# EAGLE design modul_aid (EAGLE 7.3.0)
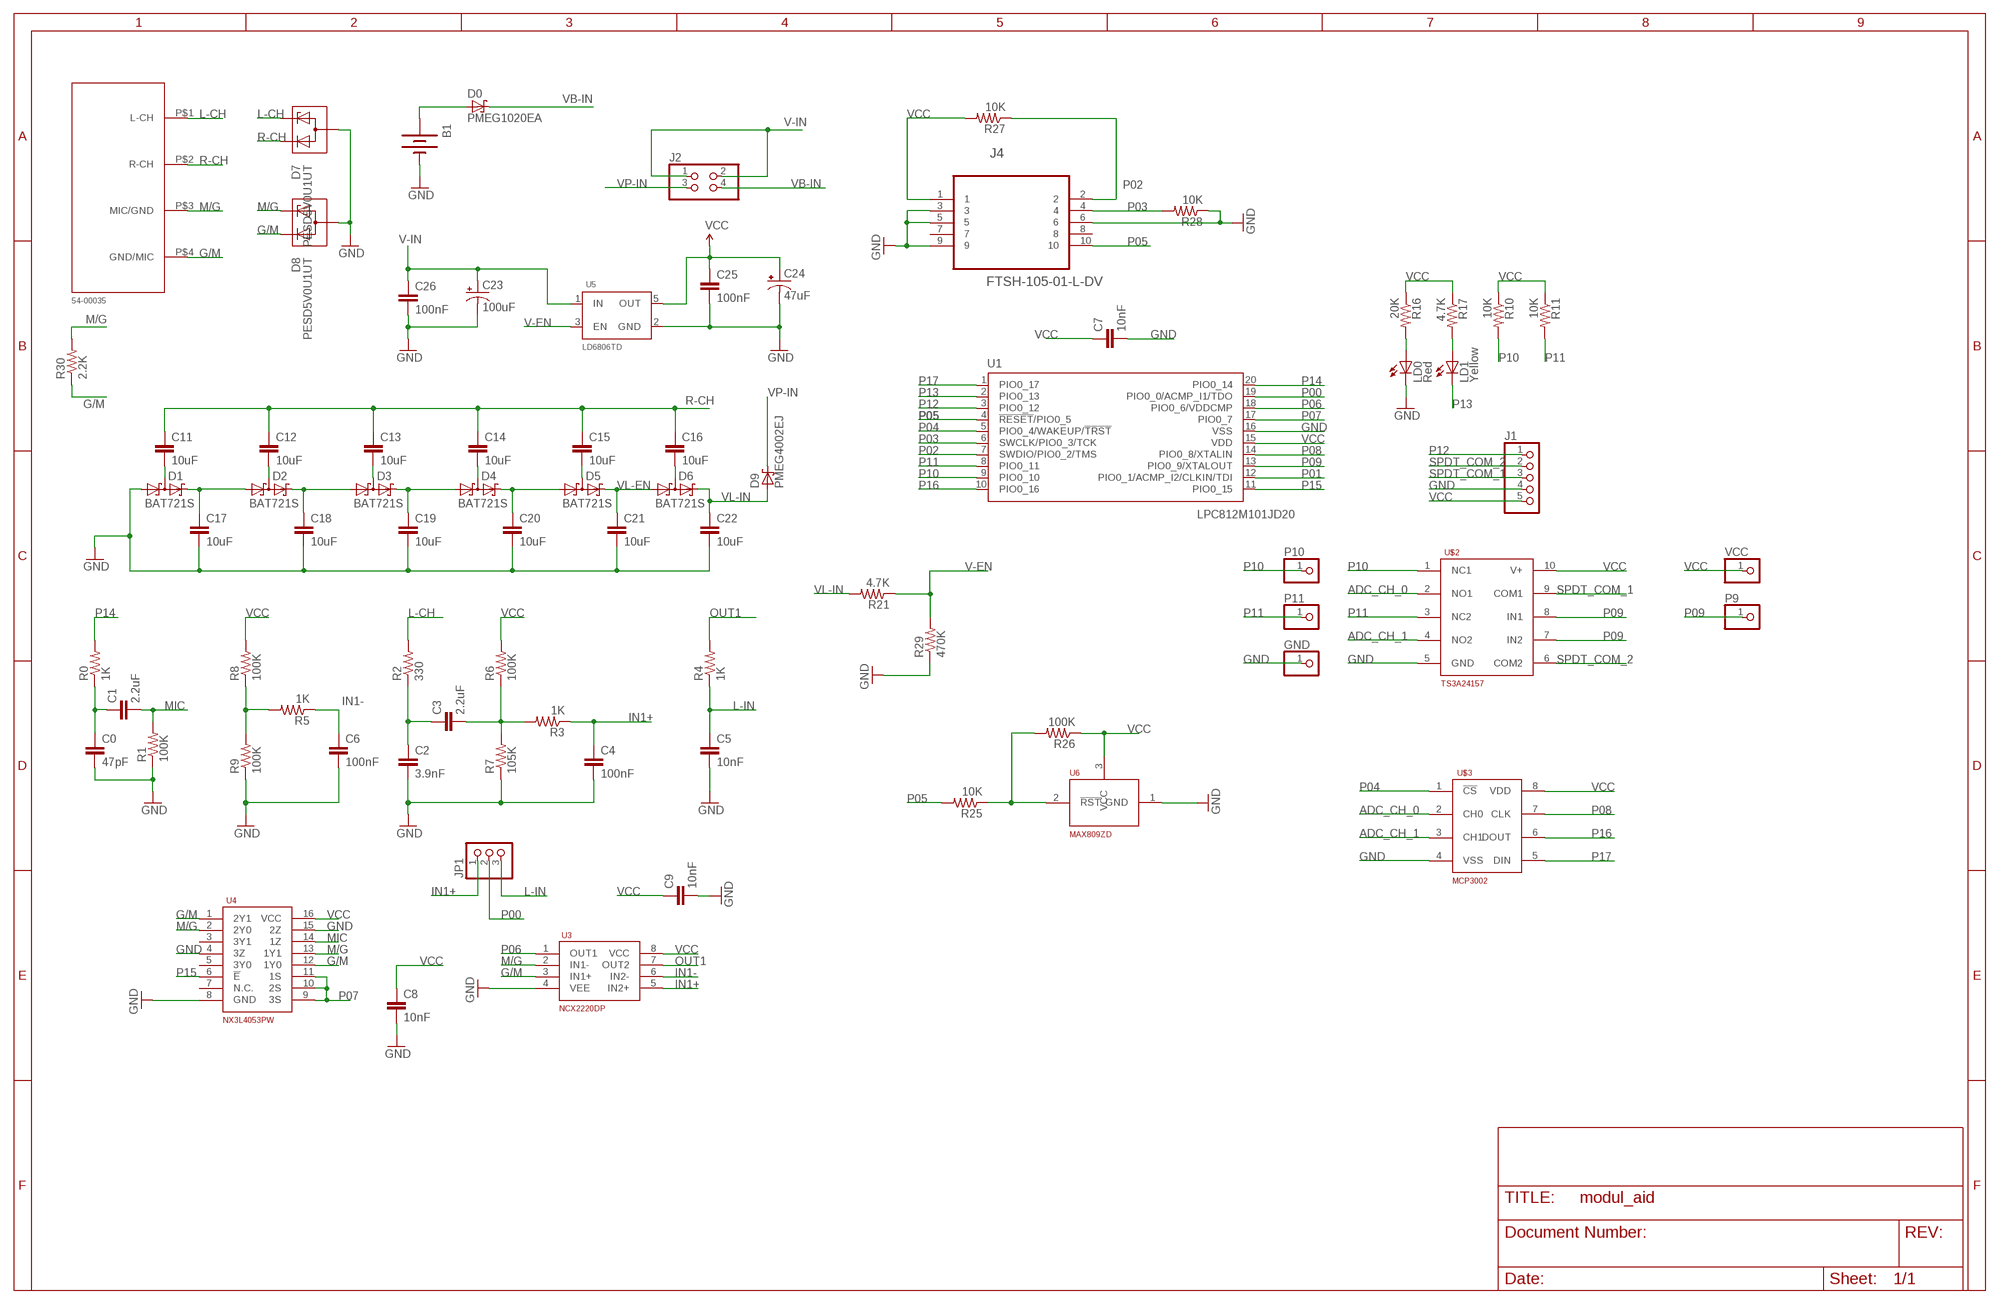
[diagram p0: schematic, sheet 1]

## Parts
B1  BATTERY20PTH  [BATTCOM_20MM_PTH]
C0  47pF  10UF10V10%(0805)  [0805-CAP]
C1  2.2uF  10UF10V10%(0805)  [0805-CAP]
C2  3.9nF  10UF10V10%(0805)  [0805-CAP]
C3  2.2uF  10UF10V10%(0805)  [0805-CAP]
C4  100nF  10UF10V10%(0805)  [0805-CAP]
C5  10nF  10UF10V10%(0805)  [0805-CAP]
C6  100nF  10UF10V10%(0805)  [0805-CAP]
C7  10nF  CAP0805  [0805]
C8  10nF  10UF10V10%(0805)  [0805-CAP]
C9  10nF  10UF10V10%(0805)  [0805-CAP]
C11  10uF  10UF10V10%(0805)  [0805-CAP]
C12  10uF  10UF10V10%(0805)  [0805-CAP]
C13  10uF  10UF10V10%(0805)  [0805-CAP]
C14  10uF  10UF10V10%(0805)  [0805-CAP]
C15  10uF  10UF10V10%(0805)  [0805-CAP]
C16  10uF  10UF10V10%(0805)  [0805-CAP]
C17  10uF  10UF10V10%(0805)  [0805-CAP]
C18  10uF  10UF10V10%(0805)  [0805-CAP]
C19  10uF  10UF10V10%(0805)  [0805-CAP]
C20  10uF  10UF10V10%(0805)  [0805-CAP]
C21  10uF  10UF10V10%(0805)  [0805-CAP]
C22  10uF  10UF10V10%(0805)  [0805-CAP]
C23  100uF  CAP_POL1206-KIT  [EIA3216-KIT]
C24  47uF  CAP_POL1206-KIT  [EIA3216-KIT]
C25  100nF  CAP0805  [0805]
C26  100nF  CAP0805  [0805]
D0  PMEG1020EA  [SOD323(F)]
D1  BAT721S  [SOT23]
D2  BAT721S  [SOT23]
D3  BAT721S  [SOT23]
D4  BAT721S  [SOT23]
D5  BAT721S  [SOT23]
D6  BAT721S  [SOT23]
D7  PESD5V0U1UT  [SOT23]
D8  PESD5V0U1UT  [SOT23]
D9  PMEG4002EJ  [SOD323(F)]
GND  PINHD-1X1  [1X01]
J1  PINHD-1X5  [1X05]
J2  PINHD-2X2  [2X02]
J4  FTSH-105-01-L-DV  [SAMTEC_FTSH-105-01-L-DV]
JP1  PINHD-1X3  [1X03]
LD0  Red  LEDSML0805  [SML0805]
LD1  Yellow  LEDSML0805  [SML0805]
P9  PINHD-1X1  [1X01]
P10  PINHD-1X1  [1X01]
P11  PINHD-1X1  [1X01]
R0  1K  RESISTOR0805-RES  [0805]
R1  100K  RESISTOR0805-RES  [0805]
R2  330  RESISTOR0805-RES  [0805]
R3  1K  RESISTOR0805-RES  [0805]
R4  1K  RESISTOR0805-RES  [0805]
R5  1K  RESISTOR0805-RES  [0805]
R6  100K  RESISTOR0805-RES  [0805]
R7  105K  RESISTOR0805-RES  [0805]
R8  100K  RESISTOR0805-RES  [0805]
R9  100K  RESISTOR0805-RES  [0805]
R10  10K  RESISTOR0805-RES  [0805]
R11  10K  RESISTOR0805-RES  [0805]
R16  20K  RESISTOR0805-RES  [0805]
R17  4.7K  RESISTOR0805-RES  [0805]
R21  4.7K  RESISTOR0805-RES  [0805]
R25  10K  RESISTOR0805-RES  [0805]
R26  100K  RESISTOR0805-RES  [0805]
R27  10K  RESISTOR0805-RES  [0805]
R28  10K  RESISTOR0805-RES  [0805]
R29  470K  RESISTOR0805-RES  [0805]
R30  2.2K  RESISTOR0805-RES  [0805]
U1  LPC812M101JD20  [SOT163-1]
U3  NCX2220DP  [SOT505-2]
U4  NX3L4053PW  [S0T403-1]
U5  LD6806TD  [SOT753]
U6  MAX809ZD  [SOT23-3]
U$2  TS3A24157  [VSSOP-10]
U$3  MCP3002  [SOIC8]
U$4  TENSILITY54-00035  [EE464SAUDIOJACK]
VCC  PINHD-1X1  [1X01]

## Nets
ADC_CH_0: U$2.2(NO1) U$3.2(CH0)
ADC_CH_1: U$2.4(NO2) U$3.3(CH1)
G/M: D8.2(KD) R30.1 U3.3(IN1+) U4.1(2Y1) U4.12(1Y0) U$4.P$4(GND/MIC)
GND: B1.2(-) C0.2 C2.2 C4.2 C5.2 C6.2 C7.2 C8.2 C9.2 C17.2 C18.2 C19.2 C20.2 C21.2 C22.2 C23.C(-) C24.C(-) C25.2 C26.2 D1.1(A1) D7.3(CA) D8.3(CA) GND.1 J1.4 J4.3 J4.5 J4.6 J4.9 LD0.C R1.1 R7.1 R9.1 R28.1 R29.1 U1.16(VSS) U3.4(VEE) U4.4(3Z) U4.8(GND) U4.15(2Z) U5.2(GND) U6.1(GND) U$2.5(GND) U$3.4(VSS)
IN1+: C4.1 JP1.1 R3.1 U3.5(IN2+)
IN1-: C6.1 R5.1 U3.6(IN2-)
L-CH: D7.1(KESD) R2.2 U$4.P$1(L-CH)
L-IN: C5.1 JP1.3 R4.1
M/G: D8.1(KESD) R30.2 U3.2(IN1-) U4.2(2Y0) U4.13(1Y1) U$4.P$3(MIC/GND)
MIC: C1.2 R1.2 U4.14(1Z)
N$1: C11.2 D1.3(K1A2)
N$2: C12.2 D2.3(K1A2)
N$3: C13.2 D3.3(K1A2)
N$4: C14.2 D4.3(K1A2)
N$5: C15.2 D5.3(K1A2)
N$6: C16.2 D6.3(K1A2)
N$7: B1.1(+) D0.2(A)
N$8: C0.1 C1.1 R0.1
N$9: C17.1 D1.2(K2) D2.1(A1)
N$10: C18.1 D2.2(K2) D3.1(A1)
N$11: C19.1 D3.2(K2) D4.1(A1)
N$12: C20.1 D4.2(K2) D5.1(A1)
N$13: R5.2 R8.1 R9.2
N$14: C2.1 C3.1 R2.1
N$16: R25.1 R26.2 U6.2(!RST)
N$17: C3.2 R3.2 R6.1 R7.2
N$18: LD0.A R16.2
N$19: LD1.A R17.2
OUT1: R4.2 U3.7(OUT2)
P00: JP1.2 U1.19(PIO0_0/ACMP_I1/TDO)
P01: U1.12(PIO0_1/ACMP_I2/CLKIN/TDI)
P02: J4.2 R27.1 U1.7(SWDIO/PIO0_2/TMS)
P03: J4.4 R28.2 U1.6(SWCLK/PIO0_3/TCK)
P04: U1.5(PIO0_4/WAKEUP/!TRST!) U$3.1(!CS)
P05: J4.10 R25.2 U1.4(!RESET!/PIO0_5)
P06: U1.18(PIO0_6/VDDCMP) U3.1(OUT1)
P07: U1.17(PIO0_7) U4.9(3S) U4.10(2S) U4.11(1S)
P08: U1.14(PIO0_8/XTALIN) U$3.7(CLK)
P09: P9.1 U1.13(PIO0_9/XTALOUT) U$2.7(IN2) U$2.8(IN1)
P10: P10.1 R10.2 U1.9(PIO0_10) U$2.1(NC1)
P11: P11.1 R11.2 U1.8(PIO0_11) U$2.3(NC2)
P12: J1.1 U1.3(PIO0_12)
P13: LD1.C U1.2(PIO0_13)
P14: R0.2 U1.20(PIO0_14)
P15: U1.11(PIO0_15) U4.6(!E)
P16: U1.10(PIO0_16) U$3.6(DOUT)
P17: U1.1(PIO0_17) U$3.5(DIN)
R-CH: C11.1 C12.1 C13.1 C14.1 C15.1 C16.1 D7.2(KD) U$4.P$2(R-CH)
SPDT_COM_1: J1.3 U$2.9(COM1)
SPDT_COM_2: J1.2 U$2.6(COM2)
V-EN: R21.1 R29.2 U5.3(EN)
V-IN: C23.A(+) C26.1 J2.1 J2.2 U5.1(IN)
VB-IN: D0.1(K) J2.4
VCC: C7.1 C8.1 C9.1 C24.A(+) C25.1 J1.5 J4.1 R6.2 R8.2 R10.1 R11.1 R16.1 R17.1 R26.1 R27.2 U1.15(VDD) U3.8(VCC) U4.16(VCC) U5.5(OUT) U6.3(VCC) U$2.10(V+) U$3.8(VDD) VCC.1
VL-EN: C21.1 D5.2(K2) D6.1(A1)
VL-IN: C22.1 D6.2(K2) D9.2(A) R21.2
VP-IN: D9.1(K) J2.3
Unconnected: J4.7 J4.8 U4.3(3Y1) U4.5(3Y0) U4.7(N.C.)

## Library data of the parts
B1 = SparkFun-Electromechanical:BATTERY: Battery Holders Various common sizes : AA, AAA, 18650 (PRT-12895), 20mm coin cell and 12mm coin cell. 20MM_4LEGS, BATT-10373
C0 C1-C6 C8 C9 C11-C22 = SparkFun-Capacitors:10UF10V10%(0805): CAP-11330; PROD_ID: CAP-11330
C7 C25 C26 = SparkFun-Capacitors:CAP: Capacitor Standard 0603 ceramic capacitor, and 0.1" leaded capacitor.
C23 C24 = SparkFun-Capacitors:CAP_POL: Capacitor Polarized These are standard SMD and PTH capacitors. Normally 10uF, 47uF, and 100uF in electrolytic and tantalum varieties. Always verify the external diameter of the through hole cap, it varies with capacity, voltage, and manufacturer. The EIA devices should be standard.
D0 = NXP_60_26022015:PMEG1020E: 10 V, 2 A ultra low VF MEGA Schottky barrier rectifiers Planar Maximum Efficiency General Application (MEGA) Schottky barrier rectifiers with an integrated guard ring for stress protection, encapsulated in small and flat lead plastic SMD packages. AAL Eindhoven MK
D1-D6 = NXP_60_26022015:BAT721S: Schottky barrier diodes in small packages Planar Schottky barrier diodes with an integrated guard ring for stress protection. Encapsulated in small Surface-Mounted Device (SMD) plastic packages. AAL Eindhoven MK
D7 D8 = NXP_60_26022015:PESD5V0U1UT: Ultra low capacitance ESD protection diode in SOT23 package Ultra low capacitance ElectroStatic Discharge (ESD) protection diode in a SOT23 (TO-236AB) small SMD plastic package designed to protect one high-speed data line from the damage caused by ESD and other transients. AAL Eindhoven MK
D9 = NXP_60_26022015:PMEG4002: 40 V 0.2 A Very low VF MEGA Schottky barrier rectifier Planar Maximum Efficiency General Application (MEGA) Schottky barrier rectifier with an integrated guard ring for stress protection, encapsulated in a SOD323 (SC-76) very small SMD plastic packag AAL Eindhoven MK
GND P9-P11 VCC = pinhead:PINHD-1X1: PIN HEADER
J1 = pinhead:PINHD-1X5: PIN HEADER
J2 = pinhead:PINHD-2X2: PIN HEADER
J4 = SAMTEC-HTSW-FTxx_By_element14_Batch_1:FTSH-105-01-L-DV: CONN HEADER, 1.27MM, 2X5WAY, SMT; MPN: FTSH-105-01-L-DV; OC_FARNELL: 1667759; OC_NEWARK: 11P4814; PACKAGE: HEADER, 1.27MM, 2X5WAY, SMT; SUPPLIER: SAMTEC
JP1 = pinhead:PINHD-1X3: PIN HEADER
LD0 LD1 = led:LED: LED OSRAM: - CHIPLED LG R971, LG N971, LY N971, LG Q971, LY Q971, LO R971, LY R971 LH N974, LH R974 LS Q976, LO Q976, LY Q976 LO Q996 - Hyper CHIPLED LW Q18S LB Q993, LB Q99A, LB R99A - SideLED LS A670, LO A670, LY A670, LG A670, LP A670 LB A673, LV A673, LT A673, LW A673 LH A674 LY A675 LS A676, LA A676, LO A676, LY A676, LW A676 LS A679, LY A679, LG A679 - Hyper Micro SIDELED® LS Y876, LA Y876, LO Y876, LY Y876 LT Y87S - SmartLED LW L88C, LW L88S LB L89C, LB L89S, LG L890 LS L89K, LO L89K, LY L89K LS L896, LA L896, LO L896, LY L896 - TOPLED LS T670, LO T670, LY T670, LG T670, LP T670 LSG T670, LSP T670, LSY T670, LOP T670, LYG T670 LG T671, LOG T671, LSG T671 LB T673, LV T673, LT T673, LW T673 LH T674 LS T676, LA T676, LO T676, LY T676, LB T676, LH T676, LSB T676, LW T676 LB T67C, LV T67C, LT T67C, LS T67K, LO T67K, LY T67K, LW E67C LS E67B, LA E67B, LO E67B, LY E67B, LB E67C, LV E67C, LT E67C LW T67C LS T679, LY T679, LG T679 LS T770, LO T770, LY T770, LG T770, LP T770 LB T773, LV T773, LT T773, LW T773 LH T774 LS E675, LA E675, LY E675, LS T675 LS T776, LA T776, LO T776, LY T776, LB T776 LHGB T686 LT T68C, LB T68C - Hyper Mini TOPLED® LB M676 - Mini TOPLED Santana® LG M470 LS M47K, LO M47K, LY M47K Source: http://www.osram.convergy.de LUXEON: - LUMILED® LXK2-PW12-R00, LXK2-PW12-S00, LXK2-PW14-U00, LXK2-PW14-V00 LXK2-PM12-R00, LXK2-PM12-S00, LXK2-PM14-U00 LXK2-PE12-Q00, LXK2-PE12-R00, LXK2-PE12-S00, LXK2-PE14-T00, LXK2-PE14-U00 LXK2-PB12-K00, LXK2-PB12-L00, LXK2-PB12-M00, LXK2-PB14-N00, LXK2-PB14-P00, LXK2-PB14-Q00 LXK2-PR12-L00, LXK2-PR12-M00, LXK2-PR14-Q00, LXK2-PR14-R00 LXK2-PD12-Q00, LXK2-PD12-R00, LXK2-PD12-S00 LXK2-PH12-R00, LXK2-PH12-S00 LXK2-PL12-P00, LXK2-PL12-Q00, LXK2-PL12-R00 Source: www.luxeon.com KINGBRIGHT: KA-3528ASYC Source: www.kingbright.com
R0 R1-R11 R16 R17 R21 R25-R30 = SparkFun-Resistors:RESISTOR: Resistor Basic schematic elements and footprints for 0603, 1206, and PTH resistors.
U1 = NXP_60_26022015:LPC812M101: 32-bit ARM Cortex-M0+ microcontroller The LPC81xM are an ARM Cortex-M0+ based, low-cost 32-bit MCU family operating at CPU frequencies of up to 30 MHz. The LPC81xM support up to 16 kB of flash memory and 4 kB of SRAM. The peripheral complement of the LPC81xM includes a CRC engine, one I 2 C-bus interface, up to three USARTs, up to two SPI interfaces, one multi-rate timer, self wake-up timer, and state-configurable timer, one comparator, function-configurable I/O ports through a switch matrix, an input pattern match engine, and up to 18 general-purpose I/O pins. AAL Eindhoven MK; COMP: 1; FLASH: 16k; GPIO: 18; I2C: 1; SPI: 1; SRAM: 4k; USART: 2
U3 = myNXP:NCX2220DP
U4 = myNXP:NX3L4053PW
U5 = NXP_60_26022015:LD6806: Ultra low-dropout regulator, low noise, 200 mA The LD6806 series is a small-size Low-DropOut regulator (LDO) family with a typical voltage drop of 60 mV at 200 mA current rating. The device is available in three different surface-mounted packages, one 0.4 mm pitch CSP, one leadless plastic package SOT886 and one gull wing package SOT753. The operating voltage ranges from 2.3 V to 5.5 V and the output voltage ranges from 1.2 V to 3.6 V. LD6806x/xxH devices show a high-ohmic state at the output pin, while the LD6806x/xxP contains a pull-down switching transistor, to provide a low-ohmic output stage when the device is disabled. All devices use the same regulator design and are manufactured in monolithic silicon technology. These features make the LD6806 series ideal for use in applications requiring component miniaturization, such as mobile phone handsets, cordless telephones and personal digital devices.
U6 = myNXP:MAX809ZD
U$2 = myNXP:TS3A24157
U$3 = myNXP:MCP3002
U$4 = EE464S:TENSILITY54-00035: This part is an audio jack used to EE 464S project. (TENSILITY 54-00035)

## Board
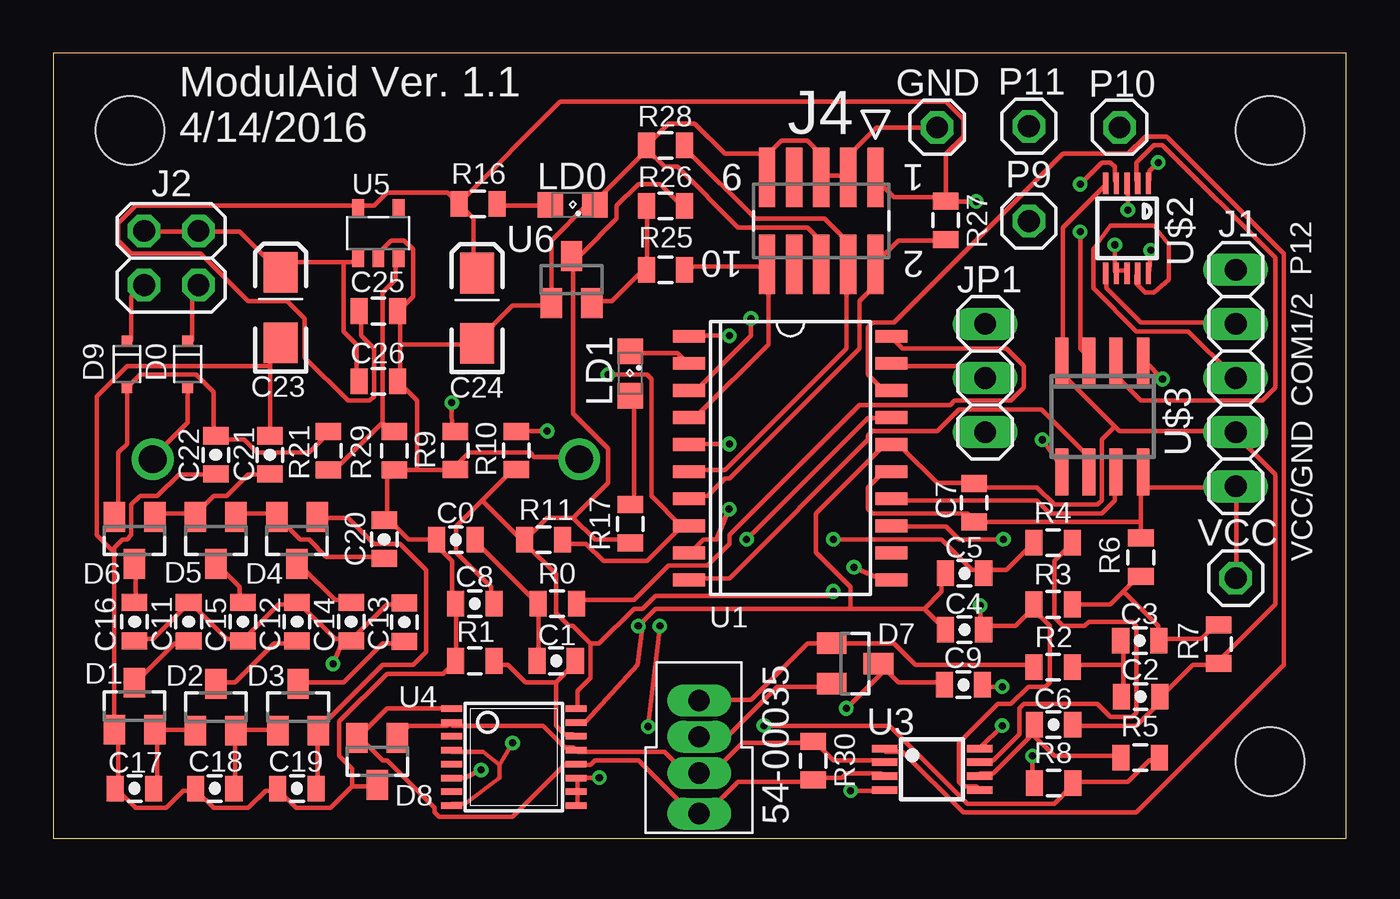
[diagram p1: board, top side]
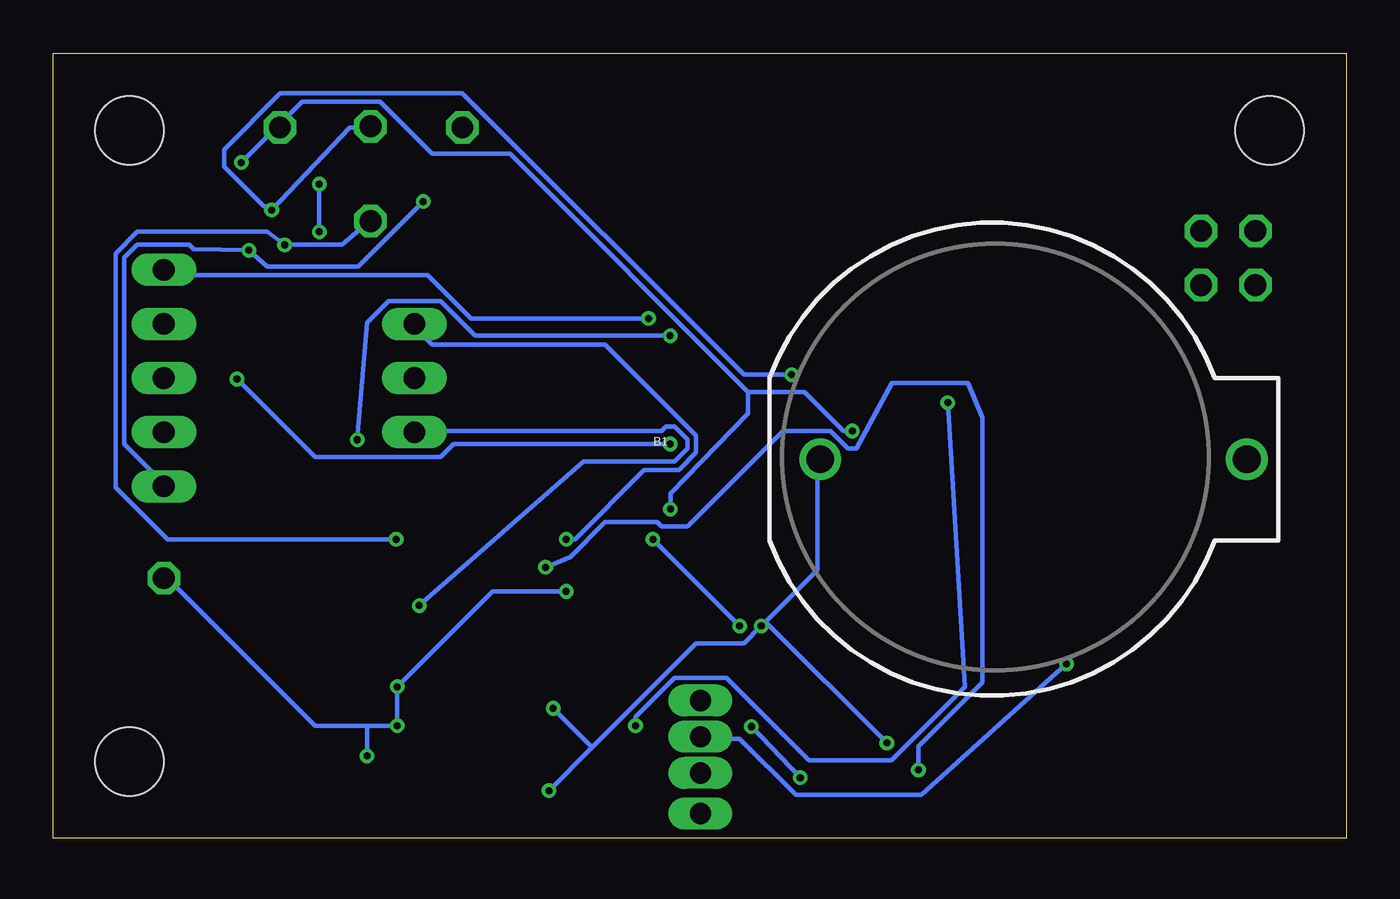
[diagram p2: board, bottom side, seen from below]

Size 60.63 x 36.82 mm. Coordinates in mm from the lower left corner, seen from the top.
Outline: 0,0 60.63,0 60.63,36.82 0,36.82 0,0
Copper layers (1*16): Top 0.0356mm / dielectric 1.5011mm / Bottom 0.0356mm
Design rules "LaenPCBOrder (1) *": minimum track width 8mil, minimum drill 13mil, track to track 8mil, track to pad 7mil, pad to pad 7mil, via to via 7mil, smd to smd 7mil, copper to edge 15mil, drill to drill 6mil, minimum pad ring 7mil, minimum via ring 7mil, stop-mask expansion 3mil, vias tented up to drill 0mil, thermal gap 10mil
Holes 3.2 mm at 3.6,33.2 57.05,33.2 57.05,3.6

### Footprints (pad centres in the part's own frame; a part is rotated, then mirrored left to right if it is on the bottom)
BATTCOM_20MM_PTH = drill 1.3: 1 11.85,0; 2 -8.15,0
0805-CAP = smd 0.8 x 1.2: 1 -0.9,0; 2 0.9,0
0805 = smd 0.8 x 1.2: 1 -0.9,0; 2 0.9,0
EIA3216-KIT = smd 1.9 x 1.6: A 1.65,0; C -1.65,0
SOD323(F) = smd 0.5 x 0.5: 1 1.1,0; 2 -1.1,0
SOT23 = smd 1 x 1.4: 1 -0.95,-1.1; 2 0.95,-1.1; 3 0,1.1
1X01 = drill 1.016 octagon: 1 0,0
1X05 = drill 1.016 long: 1 -5.08,0; 2 -2.54,0; 3 0,0; 4 2.54,0; 5 5.08,0
2X02 = drill 1.016 octagon: 1 -1.27,-1.27; 2 -1.27,1.27; 3 1.27,-1.27; 4 1.27,1.27
SAMTEC_FTSH-105-01-L-DV = smd 0.762 x 2.794: 1 -2.54,-2.032; 2 -2.54,2.032; 3 -1.27,-2.032; 4 -1.27,2.032; 5 0,-2.032; 6 0,2.032; 7 1.27,-2.032; 8 1.27,2.032; 9 2.54,-2.032; 10 2.54,2.032
1X03 = drill 1.016 long: 1 -2.54,0; 2 0,0; 3 2.54,0
SML0805 = smd 1.2 x 1.2: A 1.05,0; C -1.05,0
SOT163-1 = smd 0.6 x 1.5: 1 -5.715,-4.75; 2 -4.445,-4.75; 3 -3.175,-4.75; 4 -1.905,-4.75; 5 -0.635,-4.75; 6 0.635,-4.75; 7 1.905,-4.75; 8 3.175,-4.75; 9 4.445,-4.75; 10 5.715,-4.75; 11 5.715,4.75; 12 4.445,4.75; 13 3.175,4.75; 14 1.905,4.75; 15 0.635,4.75; 16 -0.635,4.75; 17 -1.905,4.75; 18 -3.175,4.75; 19 -4.445,4.75; 20 -5.715,4.75
SOT505-2 = smd 0.35 x 1.2: 1 -0.975,-2.925; 2 -0.325,-2.925; 3 0.325,-2.925; 4 0.975,-2.925; 5 0.975,1.525; 6 0.325,1.525; 7 -0.325,1.525; 8 -0.975,1.525
S0T403-1 = smd 0.305 x 0.991: 1 -2.275,-2.918; 2 -1.625,-2.918; 3 -0.975,-2.918; 4 -0.325,-2.918; 5 0.325,-2.918; 6 0.975,-2.918; 7 1.625,-2.918; 8 2.275,-2.918; 9 2.275,2.918; 10 1.625,2.918; 11 0.975,2.918; 12 0.325,2.918; 13 -0.325,2.918; 14 -0.975,2.918; 15 -1.625,2.918; 16 -2.275,2.918
SOT753 = smd 0.55 x 0.8: 1 -0.95,-1.2; 2 0,-1.2; 3 0.95,-1.2; 4 0.95,1.2; 5 -0.95,1.2
SOT23-3 = smd 1 x 1.4: 1 -0.95,-1.1; 2 0.95,-1.1; 3 0,1.1
VSSOP-10 = smd 0.25 x 1: 1 -1,-2.113; 2 -0.5,-2.113; 3 0,-2.113; 4 0.5,-2.113; 5 1,-2.113; 6 1,2.113; 7 0.5,2.113; 8 0,2.113; 9 -0.5,2.113; 10 -1,2.113
SOIC8 = smd 0.6 x 2.2: 1 -1.905,-2.6; 2 -0.635,-2.6; 3 0.635,-2.6; 4 1.905,-2.6; 5 1.905,2.6; 6 0.635,2.6; 7 -0.635,2.6; 8 -1.905,2.6
EE464SAUDIOJACK = drill 1 pad 1.27 long: P$1 0,3.2; P$2 0,1.5; P$3 0,-0.2 | drill 1 pad 1.422 long: P$4 0,-2.1

### Placement (x,y rotation side)
B1  16.51,17.78 0 bottom
C0  18.88,14 180 top
C1  23.58,8.32 0 top
C2  50.99,6.65 0 top
C3  50.95,9.27 0 top
C4  42.73,9.79 180 top
C5  42.73,12.43 180 top
C6  46.9,5.33 0 top
C7  43.18,15.74 90 top
C8  19.77,11.01 180 top
C9  42.68,7.2 180 top
C11  6.35,10.16 270 top
C12  11.43,10.16 270 top
C13  16.46,10.14 270 top
C14  13.97,10.16 90 top
C15  8.89,10.16 90 top
C16  3.81,10.16 90 top
C17  3.81,2.34 180 top
C18  7.57,2.34 180 top
C19  11.43,2.34 180 top
C20  15.52,14.02 90 top
C21  10.16,17.98 90 top
C22  7.62,17.98 270 top
C23  10.66,24.9 90 top
C24  19.87,24.86 90 top
C25  15.24,24.73 0 top
C26  15.24,21.44 0 top
D0  6.3,22.24 90 top
D1  3.81,6.2 0 top
D2  7.62,6.15 0 top
D3  11.48,6.15 0 top
D4  11.43,13.97 180 top
D5  7.62,13.97 180 top
D6  3.81,13.97 180 top
D7  37.6,8.2 270 top
D8  15.19,3.61 180 top
D9  3.46,22.24 90 top
GND  41.45,33.35 0 top
J1  55.45,21.59 270 top
J2  5.53,27.22 270 top
J4  36.01,28.96 180 top
JP1  43.7,21.59 90 top
LD0  24.35,29.71 180 top
LD1  27.05,21.8 270 top
P9  45.75,28.95 0 top
P10  50,33.35 0 top
P11  45.75,33.4 0 top
R0  23.63,11.01 0 top
R1  19.77,8.32 0 top
R2  46.89,8.03 180 top
R3  46.89,10.97 0 top
R4  46.89,13.86 0 top
R5  50.97,3.79 0 top
R6  51,13.18 90 top
R7  54.64,9.11 90 top
R8  46.91,2.59 180 top
R9  18.85,18.19 90 top
R10  21.71,18.19 90 top
R11  22.99,14 0 top
R16  19.92,29.76 0 top
R17  27.05,14.75 90 top
R21  12.9,18.18 90 top
R25  28.71,26.67 0 top
R26  28.71,29.66 180 top
R27  41.84,28.99 90 top
R28  28.71,32.5 0 top
R29  15.99,18.18 90 top
R30  35.63,3.64 90 top
U1  34.56,17.83 270 top
U3  41.91,3.24 270 top
U4  21.59,3.81 270 top
U5  15.24,28.39 0 top
U6  24.3,26.2 0 top
U$2  50.35,28.61 180 top
U$3  49.2,19.78 180 top
U$4  30.28,3.26 0 top
VCC  55.45,12.2 0 top

### Tracks (layer width: path | path; a pad name or v marks a point on that pad's centre or on a via)
ADC_CH_0
  Top 0.203: U$2.2 50.8,30.89 50.8,31.7 51.61,32.51 52.02,32.51 57.3,27.23 57.3,21.13 56.69,20.52 51,20.52 49.99,21.54 49.99,22.35 U$3.2
ADC_CH_1  (via drill 0.33)
  Top 0.203: v48.16,30.68 49.17,31.7 49.58,31.7 49.78,31.5 49.78,30.89 U$2.4 | v48.16,28.45 48.16,22.96 48.56,22.55 U$3.3
  Bottom 0.203: v48.16,28.45 v48.16,30.68
G/M
  Top 0.203: U4.1 18.49,6.1 15.65,6.1 14.43,4.88 D8.2 14.43,4.67 15.44,3.66 15.65,3.66 17.88,1.42 17.88,1.22 18.09,1.02 21.54,1.02 23.98,3.45 24.38,3.45 U4.12 24.59,3.45 25.2,3.45 25.4,3.66 27.43,3.66 29.87,1.22 30.28,1.22 U$4.P$4 30.48,1.02 32.11,2.64 35.56,2.64 R30.1 35.76,2.85 36.98,2.85 37.19,3.05 38.81,3.05 U3.3
GND  (via drill 0.33)
  Top 0.203: 27.64,9.96 27.64,10.16 28.25,10.77 37.39,10.77 | 27.64,9.96 27.39,8.13 24.99,5.49 24.59,5.49 U4.15 | 40.84,10.77 37.39,10.77 | 40.84,10.77 41.66,9.96 C4.2 | 40.84,10.77 41.66,11.58 41.66,12.39 C5.2 | 37.39,10.77 37.39,11.79 35.76,13.41 35.76,15.24 38.81,18.29 39.22,18.29 U1.16 39.42,18.29 39.83,18.29 41.45,16.66 43.08,16.66 C7.2 43.28,16.46 46.13,16.46 46.94,15.65 48.97,15.65 49.17,15.85 49.17,18.69 49.78,19.3 | C6.2 47.95,5.28 50.8,5.28 52.02,6.5 C2.2 52.02,6.71 53.44,8.13 54.46,8.13 R7.1 54.66,8.33 57.3,10.97 57.3,17.07 55.47,18.9 J1.4 55.27,19.1 49.99,19.1 49.78,19.3 | U$2.5 49.38,30.68 47.35,28.65 47.35,22.55 U$3.4 47.35,22.35 47.35,21.74 49.78,19.3 | 39.01,7.92 38.81,8.13 D7.3 39.01,7.92 | 39.01,7.92 39.62,7.32 41.66,7.32 C9.2 | 20.92,3.45 20.92,2.85 19.3,1.63 18.69,1.63 U4.8 | 20.92,3.45 20.16,4.06 18.69,4.06 U4.4 | v37.39,2.23 38.81,2.23 U3.4 | v21.54,4.47 20.92,3.45 | v37.19,6.1 39.01,7.92 | 10.16,22.15 10.16,22.76 10.57,23.16 C23.C | 10.16,22.15 C21.2 | 2.85,13.41 2.85,5.28 D1.1 3.05,5.08 3.05,2.44 C17.2 3.05,2.23 3.86,1.42 5.28,1.42 6.1,2.23 6.5,2.23 C18.2 6.71,2.23 7.52,1.42 9.14,1.42 9.96,2.23 10.36,2.23 C19.2 10.57,2.23 11.38,1.42 13.01,1.42 14.02,2.44 | 2.85,13.41 2.85,13.61 3.25,14.02 3.45,14.02 3.66,14.22 3.66,15.65 4.06,16.05 4.88,16.05 5.89,17.07 7.52,17.07 C22.2 | 14.02,2.44 15.04,2.44 D8.3 | 10.16,22.15 3.45,22.15 2.03,20.73 2.03,14.22 2.85,13.41 | 33.53,32.11 33.53,31.09 J4.9 33.53,32.11 | 33.53,32.11 34.14,32.72 35.36,32.72 35.97,32.11 35.97,31.09 J4.5 36.17,31.09 37.19,31.09 J4.3 37.39,31.09 37.39,32.11 38.61,33.33 41.25,33.33 GND.1
  Top 0.203: 27.84,32.31 25.4,29.87 LD0.C 25.4,29.67 24.99,29.67 23.37,28.04 23.37,25.2 U6.1 23.16,24.99 21.54,24.99 19.91,23.37 C24.C 19.71,23.16 16.26,23.16 | 27.84,32.31 28.65,31.5 29.26,31.5 32.11,28.65 35.36,28.65 35.97,28.04 35.97,27.03 J4.6 | 27.84,32.31 R28.1 27.84,32.51 28.85,33.53 30.07,33.53 31.5,32.11 33.53,32.11 | 15.65,15.04 15.65,17.07 15.85,17.27 R29.1 16.05,17.27 17.07,17.27 | 15.65,15.04 16.66,14.02 17.88,14.02 C0.2 17.88,13.82 18.69,13.01 18.69,11.18 C8.2 18.9,10.97 18.9,8.33 R1.1 18.69,8.13 18.29,7.72 15.65,7.72 13.41,5.49 13.41,3.86 14.02,3.25 14.02,2.44 | 15.65,15.04 C20.2 | 17.07,17.27 18.69,17.27 R9.1 18.9,17.48 19.51,18.09 22.35,18.09 22.55,17.88 24.59,17.88 B1.2 | U5.2 15.24,27.43 15.85,28.04 16.46,28.04 16.87,27.64 16.87,25.4 16.26,24.79 C25.2 16.26,24.59 16.26,23.16 | 16.26,23.16 16.26,21.54 C26.2 16.26,21.34 17.07,20.52 17.07,17.27 | v27.43,9.96 27.64,9.96
  Bottom 0.203: 35.36,4.27 30.48,9.14 28.25,9.14 v27.43,9.96 27.23,10.16 | 35.36,4.27 v37.39,2.23 | 27.23,10.16 24.79,12.6 24.79,17.68 B1.2 | 27.23,10.16 v21.54,4.47 | 35.36,4.27 v37.19,6.1
IN1+  (via drill 0.33)
  Top 0.203: 45.92,10.77 46.74,9.96 46.74,7.32 46.53,7.11 45.72,7.11 44.91,6.3 44.3,6.3 42.47,4.47 42.47,2.64 42.67,2.44 43.28,2.44 U3.5 | 45.92,10.77 45.11,9.96 43.69,9.96 C4.1 43.48,9.96 v43.47,10.92 | 45.92,10.77 R3.1
  Bottom 0.203: v43.47,10.92 35.76,17.68 31.5,17.68 30.89,18.29 30.89,18.69 31.5,19.3 31.9,19.3 32.11,19.1 43.69,19.1 JP1.1
IN1-
  Top 0.203: 45.92,4.88 44.09,3.05 43.48,3.05 U3.6 | 45.92,4.88 45.92,5.28 C6.1 45.92,4.88 | 45.92,4.88 46.94,3.86 49.99,3.86 R5.1
L-CH
  Top 0.203: R2.2 45.92,8.13 40.44,8.13 39.42,9.14 36.58,9.14 D7.1 36.37,9.14 35.36,9.14 32.72,6.5 30.48,6.5 U$4.P$1
L-IN  (via drill 0.33)
  Top 0.203: R4.1 45.92,13.82 44.7,12.6 43.69,12.6 C5.1 43.48,12.6 43.08,12.6 41.66,14.02 v36.58,14.02
  Bottom 0.203: v36.58,14.02 36.17,14.02 32.92,17.27 31.29,17.27 30.48,18.09 30.48,18.9 34.75,23.16 42.88,23.16 43.69,23.98 JP1.3
M/G
  Top 0.203: U3.2 38.81,3.66 36.58,3.66 35.76,4.47 R30.2 35.56,4.47 32.31,4.47 31.09,3.25 30.48,3.25 U$4.P$3 30.28,3.25 29.46,3.25 28.65,4.06 24.59,4.06 U4.13 24.38,4.27 23.98,4.27 22.96,5.28 18.69,5.28 U4.2 18.49,5.28 16.66,5.28 16.26,4.88 D8.1
MIC
  Top 0.203: 23.57,7.32 23.57,5.28 23.98,4.88 24.38,4.88 U4.14 | 23.57,7.32 24.38,8.13 C1.2 | 23.57,7.32 22.15,7.32 21.34,8.13 20.73,8.13 R1.2
N$1
  Top 0.203: C11.2 6.3,9.14 5.69,9.14 3.86,7.32 D1.3
N$2
  Top 0.203: C12.2 11.38,9.14 10.36,9.14 8.53,7.32 7.72,7.32 D2.3
N$3
  Top 0.203: C13.2 16.46,9.14 15.44,9.14 13.61,7.32 11.58,7.32 D3.3
N$4
  Top 0.203: C14.2 13.82,11.18 13.21,11.18 11.58,12.8 D4.3
N$5
  Top 0.203: C15.2 8.74,11.18 8.74,11.79 7.72,12.8 D5.3
N$6
  Top 0.203: C16.2 3.86,11.18 3.86,12.8 D6.3
N$7
  Top 0.203: D0.2 6.3,19.51 4.67,17.88 B1.1
N$8
  Top 0.203: C0.1 19.91,13.82 22.55,11.18 R0.1 22.76,10.97 22.76,8.33 C1.1
N$9
  Top 0.203: 4.88,5.08 4.88,2.44 C17.1 | 4.88,5.08 6.5,5.08 D2.1 | 4.88,5.08 D1.2
N$10
  Top 0.203: C18.1 8.53,2.44 8.53,4.88 D2.2 8.74,5.08 10.36,5.08 D3.1
N$11
  Top 0.203: C19.1 12.39,2.44 12.39,4.88 D3.2 12.39,5.08 15.44,8.13 16.87,8.13 17.48,8.74 17.48,12.6 16.26,13.82 15.04,13.82 13.82,15.04 12.39,15.04 D4.1
N$12
  Top 0.203: C20.1 15.44,13.21 12.8,13.21 11.99,14.02 11.58,14.02 10.57,15.04 D4.2 10.36,15.24 8.74,15.24 D5.1
N$13  (via drill 0.33)
  Top 0.203: v18.68,20.43 18.69,18.9 R9.2 | v33.33,5.28 39.22,5.28 42.88,1.63 46.94,1.63 47.75,2.44 R8.1 47.95,2.64 50.39,2.64 51.41,3.66 51.82,3.66 R5.2
  Bottom 0.203: v18.68,20.43 17.88,7.11 21.34,3.66 25.2,3.66 29.06,7.52 31.5,7.52 33.33,5.69 v33.33,5.28
N$14
  Top 0.203: 50.19,8.13 50.19,9.14 C3.1 | 50.19,8.13 50.19,6.71 C2.1 | 50.19,8.13 47.95,8.13 R2.1
N$16
  Top 0.203: R26.2 27.84,29.46 27.84,26.82 R25.1 27.64,26.62 26.21,25.2 25.4,25.2 U6.2
N$17
  Top 0.203: R7.2 54.46,9.96 53.85,9.35 52.02,9.35 C3.2 51.82,9.35 51.82,9.96 50.19,11.58 | 50.19,11.58 50.8,12.19 R6.1 | 50.19,11.58 49.58,10.97 47.95,10.97 R3.2
N$18
  Top 0.203: LD0.A 23.16,29.67 20.93,29.67 R16.2
N$19
  Top 0.203: R17.2 27.23,15.85 27.23,20.73 LD1.A
OUT1
  Top 0.203: U3.7 43.48,3.66 44.09,3.66 45.31,4.88 45.31,6.1 45.52,6.3 48.97,6.3 49.58,5.69 50.6,5.69 50.8,5.89 50.8,9.96 50.6,10.16 48.56,10.16 48.36,9.96 47.35,9.96 46.94,10.36 46.94,13.01 47.75,13.82 R4.2
P00
  Top 0.203: U1.19 39.42,22.15 43.28,22.15 43.69,21.74 JP1.2
P02
  Top 0.203: R27.1 41.66,28.04 39.62,28.04 38.61,27.03 J4.2 38.41,26.82 38.41,25.81 37.8,25.2 37.8,22.96 31.7,16.87 31.5,16.87 30.68,16.05 29.87,16.05 U1.7
P03
  Top 0.203: R28.2 29.67,32.31 32.92,29.06 36.17,29.06 37.19,28.04 37.19,27.03 J4.4 37.19,26.82 37.19,22.96 31.5,17.27 29.87,17.27 U1.6
P04  (via drill 0.33)
  Top 0.203: v31.7,18.49 29.87,18.49 U1.5 | v52.02,21.54 51.21,22.35 U$3.1
  Bottom 0.203: v31.7,18.49 41.86,18.49 42.47,17.88 48.36,17.88 v52.02,21.54
P05
  Top 0.203: R25.2 29.67,26.82 33.33,26.82 J4.10 33.53,26.82 33.53,23.16 30.28,19.91 29.87,19.91 U1.4
P06
  Top 0.203: U3.1 39.01,4.06 39.83,4.06 42.67,1.22 50.8,1.22 57.71,8.13 57.71,27.43 52.22,32.92 51.21,32.92 50.39,32.11 47.35,32.11 39.42,24.18 38.41,24.18 38.2,23.98 38.2,21.74 38.81,21.13 39.22,21.13 U1.18
P07  (via drill 0.33)
  Top 0.203: 24.59,2.23 24.59,1.63 U4.9 | 24.59,2.23 24.59,2.85 | 24.59,2.23 U4.10 | v25.6,2.85 24.59,2.85 | v28.45,9.96 v27.9,5.24 | v32.51,14.02 38.2,19.71 39.22,19.71 U1.17 | 24.59,2.85 U4.11
  Bottom 0.203: v27.9,5.24 v25.6,2.85 | v32.51,14.02 v28.45,9.96
P08
  Top 0.203: U1.14 39.42,15.85 46.13,15.85 46.74,15.24 49.17,15.24 49.78,15.85 49.78,17.07 U$3.7
P09  (via drill 0.33)
  Top 0.203: 49.78,26.62 50.39,26.62 U$2.8 | v49.78,27.84 49.78,26.62 | 49.78,26.62 U$2.7 | v44.56,14.02 42.47,14.02 41.86,14.63 39.42,14.63 U1.13
  Bottom 0.203: P9.1 45.92,28.85 47.09,27.84 v49.78,27.84 50.6,28.45 56.69,28.45 57.71,27.43 57.71,16.46 55.27,14.02 v44.56,14.02
P10  (via drill 0.33)
  Top 0.203: v51.82,31.7 51.41,31.29 51.41,30.89 U$2.1 | v23.16,19.1 21.74,19.1 R10.2 | v31.69,15.44 31.09,14.03 30.68,14.02 30.48,14.02 29.87,13.41 U1.9
  Bottom 0.203: v51.82,31.7 50.19,33.33 P10.1 49.99,33.53 48.97,34.54 45.31,34.54 42.88,32.11 39.22,32.11 28.04,20.93 | v23.16,19.1 23.57,19.1 25.4,20.93 28.04,20.93 | v31.69,15.44 31.69,16.17 28.04,19.91 28.04,20.93
P11  (via drill 0.33)
  Top 0.203: 29.46,14.63 29.67,14.83 U1.8 29.46,14.63 | 29.46,14.63 27.84,13.01 25.81,13.01 24.99,13.82 23.98,13.82 R11.2 | v50.39,29.47 50.39,30.68 U$2.3 | 29.46,14.63 28.04,16.05 28.04,21.54 27.84,21.74 v26.01,21.74
  Bottom 0.203: P11.1 45.92,33.33 46.74,33.33 v50.39,29.47 50.8,29.67 52.63,31.5 52.63,32.31 49.99,34.95 41.45,34.95 28.25,21.74 v26.01,21.74
P12  (via drill 0.33)
  Top 0.203: v32.72,24.38 32.72,23.57 30.28,21.13 29.87,21.13 U1.3
  Bottom 0.203: v32.72,24.38 41.05,24.38 43.08,26.42 55.07,26.42 55.27,26.62 J1.1
P13
  Top 0.203: LD1.C 27.23,22.76 29.26,22.76 29.67,22.35 U1.2
P14
  Top 0.203: R0.2 24.59,11.18 27.23,11.18 28.85,12.8 30.68,12.8 31.7,13.82 31.7,14.22 37.8,20.32 42.06,20.32 42.27,20.52 44.91,20.52 45.52,21.13 45.52,22.15 44.7,22.96 39.83,22.96 39.42,23.37 U1.20
P15  (via drill 0.33)
  Top 0.203: v20.06,3.2 19.3,2.85 18.69,2.85 U4.6 | v37.55,12.71 39.22,11.99 U1.11
  Bottom 0.203: v20.06,3.2 20.06,4.32 17.07,7.32 17.07,19.74 17.73,21.35 21.3,21.35 22.96,18.29 23.37,18.29 24.18,19.1 26.42,19.1 30.89,14.63 32.11,14.63 32.31,14.83 34.75,14.83 36.37,13.21 v37.55,12.71
P16
  Top 0.203: U1.10 29.87,12.19 31.7,12.19 38.2,18.69 38.2,18.9 38.41,19.1 41.45,19.1 42.47,20.12 46.33,20.12 48.56,17.88 48.56,17.27 U$3.6
P17  (via drill 0.33)
  Top 0.203: v31.7,23.57 29.87,23.57 U1.1 | v46.37,18.69 47.35,17.27 U$3.5
  Bottom 0.203: v31.7,23.57 40.84,23.57 42.47,25.2 44.91,25.2 45.92,24.18 v46.37,18.69
R-CH  (via drill 0.33)
  Top 0.203: D7.2 36.37,7.11 33.93,7.11 31.7,4.88 30.48,4.88 U$4.P$2 | 13.61,9.35 13.21,9.35 11.58,10.97 C12.1 11.38,10.97 10.57,10.97 8.94,9.35 C15.1 8.74,9.35 8.13,9.35 6.5,10.97 C11.1 6.3,10.97 4.67,9.35 3.86,9.35 C16.1 | 13.61,9.35 13.82,9.35 C14.1 | C13.1 16.46,10.97 15.65,10.97 14.02,9.35 C14.1 | 13.61,9.35 v13.11,8.18 | 13.61,9.35 C14.1
  Bottom 0.203: v13.11,8.18 19.91,2.03 25.81,2.03 28.45,4.67 30.28,4.67 U$4.P$2
SPDT_COM_1
  Top 0.203: U$2.9 50.8,26.42 50.8,26.01 51.21,25.6 51.61,25.6 52.32,26.21 52.32,27.84 51.61,28.75 49.58,28.75 48.77,27.64 48.77,25.81 50.8,23.77 53.24,23.77 55.27,21.74 J1.3
SPDT_COM_2
  Top 0.203: U$2.6 49.38,26.42 49.38,25.81 51,24.18 55.27,24.18 J1.2
V-EN
  Top 0.203: 15.44,19.51 15.44,25.6 16.05,26.21 16.05,27.03 U5.3 | 15.44,19.51 15.85,19.1 R29.2 | 15.44,19.51 13.41,17.48 13.01,17.48 R21.1
V-IN
  Top 0.203: J2.1 4.27,28.45 6.71,28.45 J2.2 6.91,28.45 8.74,28.45 10.57,26.62 C23.A 10.77,26.62 11.18,27.03 13.61,27.03 | 13.61,27.03 14.22,27.03 U5.1 | 13.61,27.03 13.61,23.77 14.22,23.16 14.22,21.54 C26.1
VB-IN
  Top 0.203: D0.1 6.5,23.37 6.5,25.6 6.71,25.81 J2.4
VCC  (via drill 0.33)
  Top 0.203: R27.2 41.66,30.07 39.42,30.07 38.61,30.89 J4.1 | R16.1 18.9,29.87 18.49,30.28 15.65,30.28 15.04,29.67 14.43,29.67 U5.5 14.22,29.67 3.86,29.67 3.05,28.85 3.05,28.04 3.66,27.43 6.91,27.43 9.14,25.2 10.97,25.2 11.79,24.38 11.79,22.55 13.82,20.52 14.83,20.52 15.04,20.73 15.04,22.96 14.43,23.57 14.43,24.59 C25.1 | C24.A 19.71,26.62 19.71,29.06 19.1,29.67 R16.1 | R27.2 41.86,30.07 41.86,32.11 42.67,32.92 42.67,33.73 41.86,34.54 23.77,34.54 19.1,29.87 R16.1 | 20.12,15.85 21.54,17.27 R10.1 | 20.12,15.85 18.9,14.63 18.9,13.41 20.52,11.79 20.52,11.18 C8.1 | R26.1 29.46,29.67 28.45,30.68 27.43,30.68 26.42,29.67 26.42,29.06 24.79,27.43 24.38,27.43 U6.3 24.38,27.23 24.38,19.91 26.01,18.29 26.01,16.66 24.38,15.04 | 25.2,9.14 25.2,7.52 24.59,6.91 24.59,6.1 U4.16 | 25.2,9.14 24.38,9.96 24.18,9.96 23.57,10.57 23.57,12.39 22.15,13.82 R11.1 | 24.38,15.04 25.4,14.02 27.03,14.02 R17.1 | 24.38,15.04 23.16,15.04 22.15,14.02 R11.1 | 20.12,15.85 21.95,14.02 R11.1 | v44.5,5.28 43.48,4.27 U3.8 | v44.5,7.11 43.69,7.11 C9.1 | v45.92,3.86 45.92,2.64 R8.2 | 51,16.46 51,17.07 U$3.8 51,16.46 | 51,16.46 51,14.83 | 51,14.83 51,14.22 R6.2 | 51,14.83 43.28,14.83 C7.1 43.08,15.04 42.88,15.24 38.41,15.24 38.2,15.44 38.2,16.46 38.81,17.07 39.22,17.07 U1.15 | v51.46,27.59 51.41,26.62 U$2.10 | 51,16.46 55.27,16.46 J1.5 55.47,16.46 55.47,12.39 VCC.1 | 25.2,9.14 25.6,9.14 27.23,10.77 27.64,10.77 28.25,11.38 36.37,11.38 v36.58,11.58 | v43.28,29.87 41.86,29.87 R27.2
  Bottom 0.203: 45.92,5.28 48.36,5.28 55.27,12.19 VCC.1 | 45.92,5.28 v44.5,5.28 v44.5,7.11 40.03,11.58 v36.58,11.58 | 45.92,5.28 v45.92,3.86 | J1.5 55.47,16.66 57.3,18.49 57.3,27.23 56.69,27.84 54.25,27.84 54.05,27.64 v51.46,27.59 50.6,26.82 46.33,26.82 v43.28,29.87
VL-EN
  Top 0.203: C21.1 10.16,17.07 9.14,17.07 8.13,16.05 7.52,16.05 6.71,15.24 D5.2 6.5,15.24 4.88,15.24 D6.1
VL-IN
  Top 0.203: R21.2 12.8,18.9 11.99,18.09 9.55,18.09 8.94,18.69 7.72,18.69 C22.1 7.52,18.9 7.52,20.93 6.71,21.74 4.06,21.74 3.66,21.34 D9.2 3.45,18.49 3.05,18.09 3.05,15.24 D6.2
VP-IN
  Top 0.203: D9.1 3.66,23.37 3.66,25.4 4.06,25.81 J2.3

### Text on the board
tNames: ModulAid Ver. 1.1 / 4/14/2016 | P12 | COM1/2 | VCC/GND